# EAGLE design meteo_board (EAGLE 9.6.2)
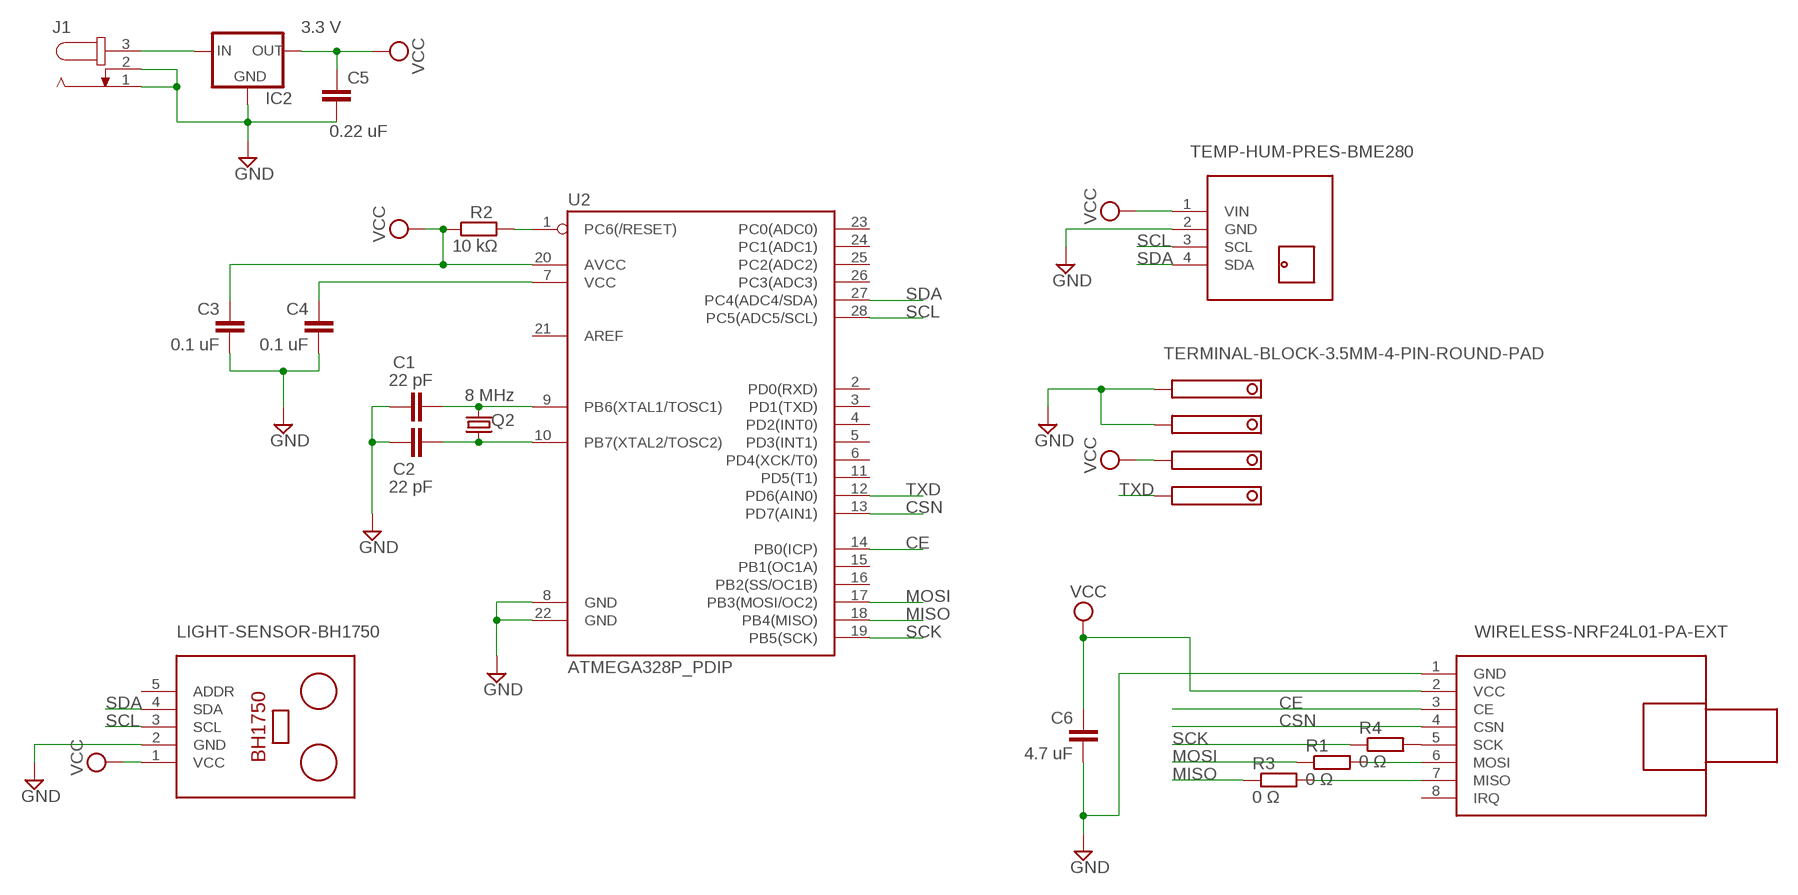
[diagram p0: schematic, sheet 1]

## Parts
C1  22 pF  C2,5-3  [C2.5-3]
C2  22 pF  C2,5-3  [C2.5-3]
C3  0.1 uF  C2,5-3  [C2.5-3]
C4  0.1 uF  C2,5-3  [C2.5-3]
C5  0.22 uF  C2,5-3  [C2.5-3]
C6  4.7 uF  C2,5-3  [C2.5-3]
IC2  LFXXCVS  [TO220S]
J1  JACK-PLUG0  [SPC4077]
M1  WIRELESS-NRF24L01-PA-EXT  [WIRELESS-NRF24L01-PA-EXT]
Q2  8 MHz  CRYSTALHC49S  [HC49/S]
R1  0 Ω  R-EU_0204/5  [0204/5]
R2  10 kΩ  R-EU_0204/5  [0204/5]
R3  0 Ω  R-EU_0204/5  [0204/5]
R4  0 Ω  R-EU_0204/5  [0204/5]
TX20  TERMINAL-BLOCK-3.5MM-4-PIN-ROUND-PAD  [TERMINAL-BLOCK-4-PIN-3.5MM-ROUND-PAD]
U2  ATMEGA328P_PDIP  [DIL28-3]
U$5  LIGHT-SENSOR-BH1750  [LIGHT-SENSOR-BH1750]
U$6  TEMP-HUM-PRES-BME280  [TEMP-HUM-PRES-BME280]

## Nets
CE: M1.3(CE) U2.14(PB0(ICP))
CSN: M1.4(CSN) U2.13(PD7(AIN1))
GND: C1.1 C2.1 C3.1 C4.1 C5.2 C6.1 IC2.2(GND) J1.1 J1.2 M1.1(GND) TX20.1 TX20.2 U2.8(GND) U2.22(GND) U$5.2(GND) U$6.2(GND)
MISO: R3.1 U2.18(PB4(MISO))
MOSI: R1.1 U2.17(PB3(MOSI/OC2))
N$1: IC2.1(IN) J1.3
N$2: R2.2 U2.1(PC6(/RESET))
N$3: M1.5(SCK) R4.2
N$4: C1.2 Q2.2 U2.9(PB6(XTAL1/TOSC1))
N$5: C2.2 Q2.1 U2.10(PB7(XTAL2/TOSC2))
N$6: M1.6(MOSI) R1.2
N$7: M1.7(MISO) R3.2
N$13: C4.2 U2.7(VCC)
SCK: R4.1 U2.19(PB5(SCK))
SCL: U2.28(PC5(ADC5/SCL)) U$5.3(SCL) U$6.3(SCL)
SDA: U2.27(PC4(ADC4/SDA)) U$5.4(SDA) U$6.4(SDA)
TXD: TX20.4 U2.12(PD6(AIN0))
VCC: C3.2 C5.1 C6.2 IC2.3(OUT) M1.2(VCC) R2.1 TX20.3 U2.20(AVCC) U$5.1(VCC) U$6.1(VIN)
Unconnected: M1.8(IRQ) U2.2(PD0(RXD)) U2.3(PD1(TXD)) U2.4(PD2(INT0)) U2.5(PD3(INT1)) U2.6(PD4(XCK/T0)) U2.11(PD5(T1)) U2.15(PB1(OC1A)) U2.16(PB2(SS/OC1B)) U2.21(AREF) U2.23(PC0(ADC0)) U2.24(PC1(ADC1)) U2.25(PC2(ADC2)) U2.26(PC3(ADC3)) U$5.5(ADDR)

## Notes on the sheet
- 3.3 V

## Library data of the parts
C1-C6 = capacitor-wima:C: CAPACITOR naming: grid - package width
IC2 = lf33:LFXXCV: VOLTAGE REGULATOR
J1 = con-jack:JACK-PLUG: DC POWER JACK Power Jack, DC, Right Angle, Through Hole, Rated 5A at 16VDC, PC Terminals Distributor: Farnell (www.Farnell.de) Drawing: 84N1161.pdf / 84N1162.pdf Manufacturer: SPC Technology (www.spctechnology.com) Type: SPC4077 / SPC 4078; OC_FARNELL: unknown; OC_NEWARK: unknown
M1 = diy-modules:WIRELESS-NRF24L01-PA-EXT: 2.4 GHz Wireless Module based on NRF24L01 chip with preamplifier and external antenna Click here to find device on ebay.com <http://www.ebay.com/sch/nrf24l01+pa+lna+sma>
Q2 = crystal:CRYSTAL: CRYSTAL; OC_FARNELL: 1667008; OC_NEWARK: unknown
R1-R4 = rcl:R-EU_: RESISTOR, European symbol; SPICEPREFIX: R
TX20 = Rembrandt Electronics - Terminal Block 3-5mm v1-0:TERMINAL-BLOCK-3.5MM-4-PIN: Terminal Block 3.5mm Pitch: 3,5 mm Number of pins: 4 Created by Rembrandt Electronics www.rembrandtelectronics.com
U2 = Bare Bones Arduino:ATMEGA328P_PDIP: uC used in the Arduino 32kb flash, 1k EEPROM, 2k SRAM This is the through-hole version of this chip.
U$5 = diy-modules:LIGHT-SENSOR-BH1750: Digital Light Sensor based on BH1750 BH1750 datasheet is available here: http://www.mouser.com/ds/2/348/bh1750fvi-e-186247.pdf Arduino Library for BH1750 is available here: https://github.com/claws/BH1750 Video Tutorial is available here: https://www.youtube.com/watch?v=UsLcHSbxf_8 Click here to find device on ebay.com <http://www.ebay.com/sch/bh1750fvi+module> Note: There are many variants. Search for the proper version.
U$6 = diy-modules:TEMP-HUM-PRES-BME280: Digital Humidity-Temperature-Pressure Sensor based on BME280 device More information about BME280 device is available here: https://www.bosch-sensortec.com/bst/products/all_products/bme280 Click here to find device on ebay.com <http://www.ebay.com/sch/bme280+breakout>

## Board
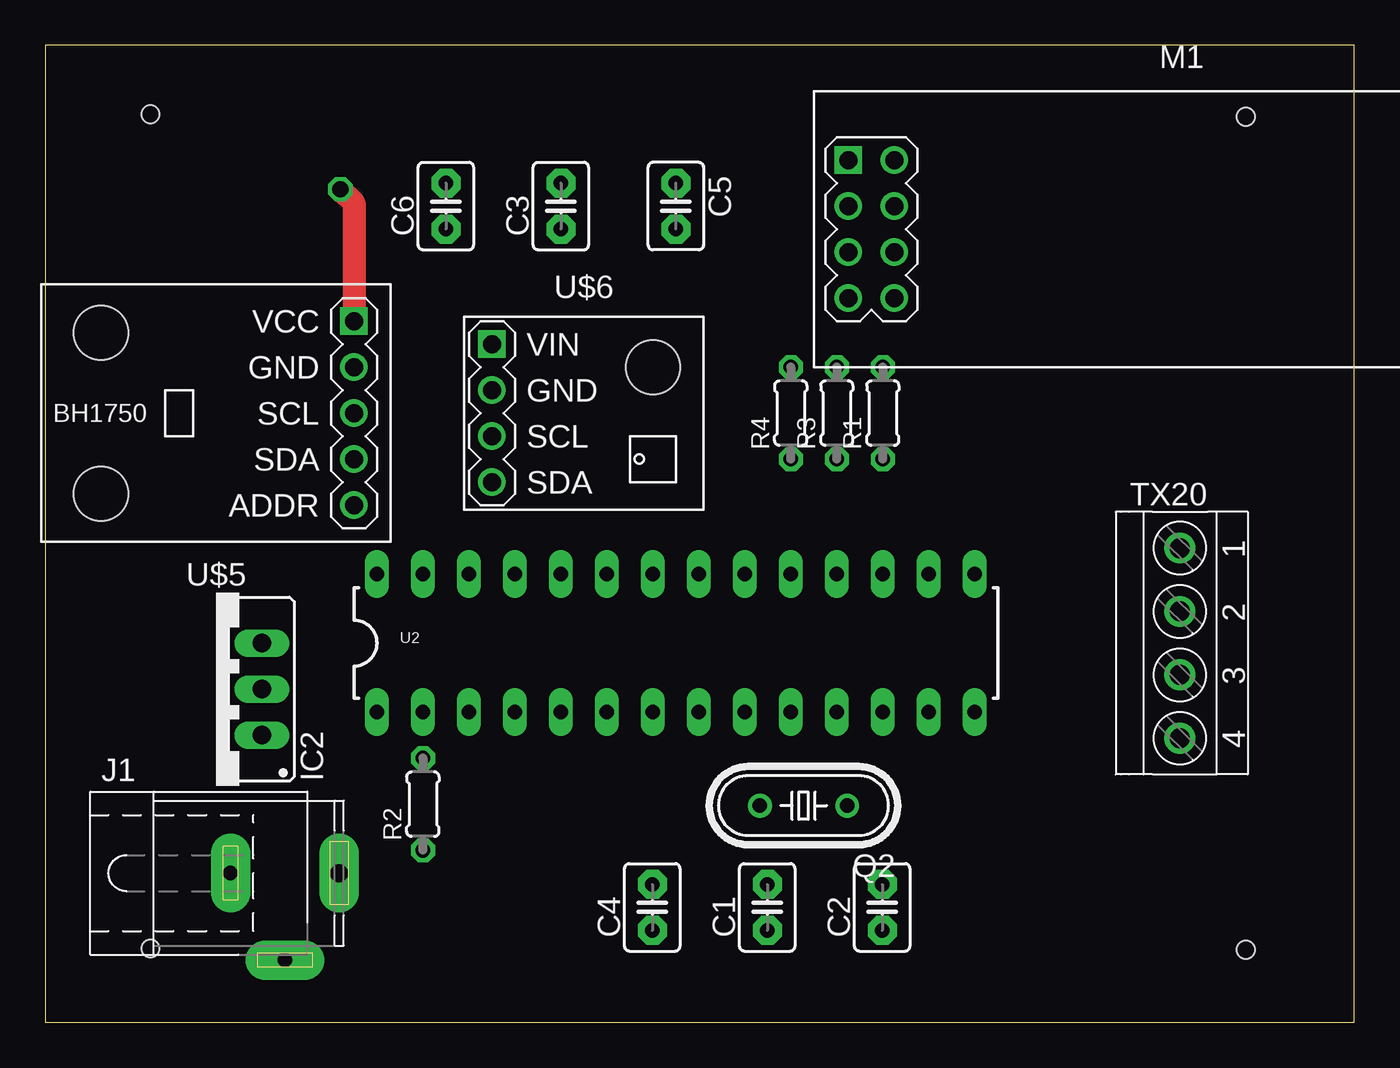
[diagram p1: board, top side]
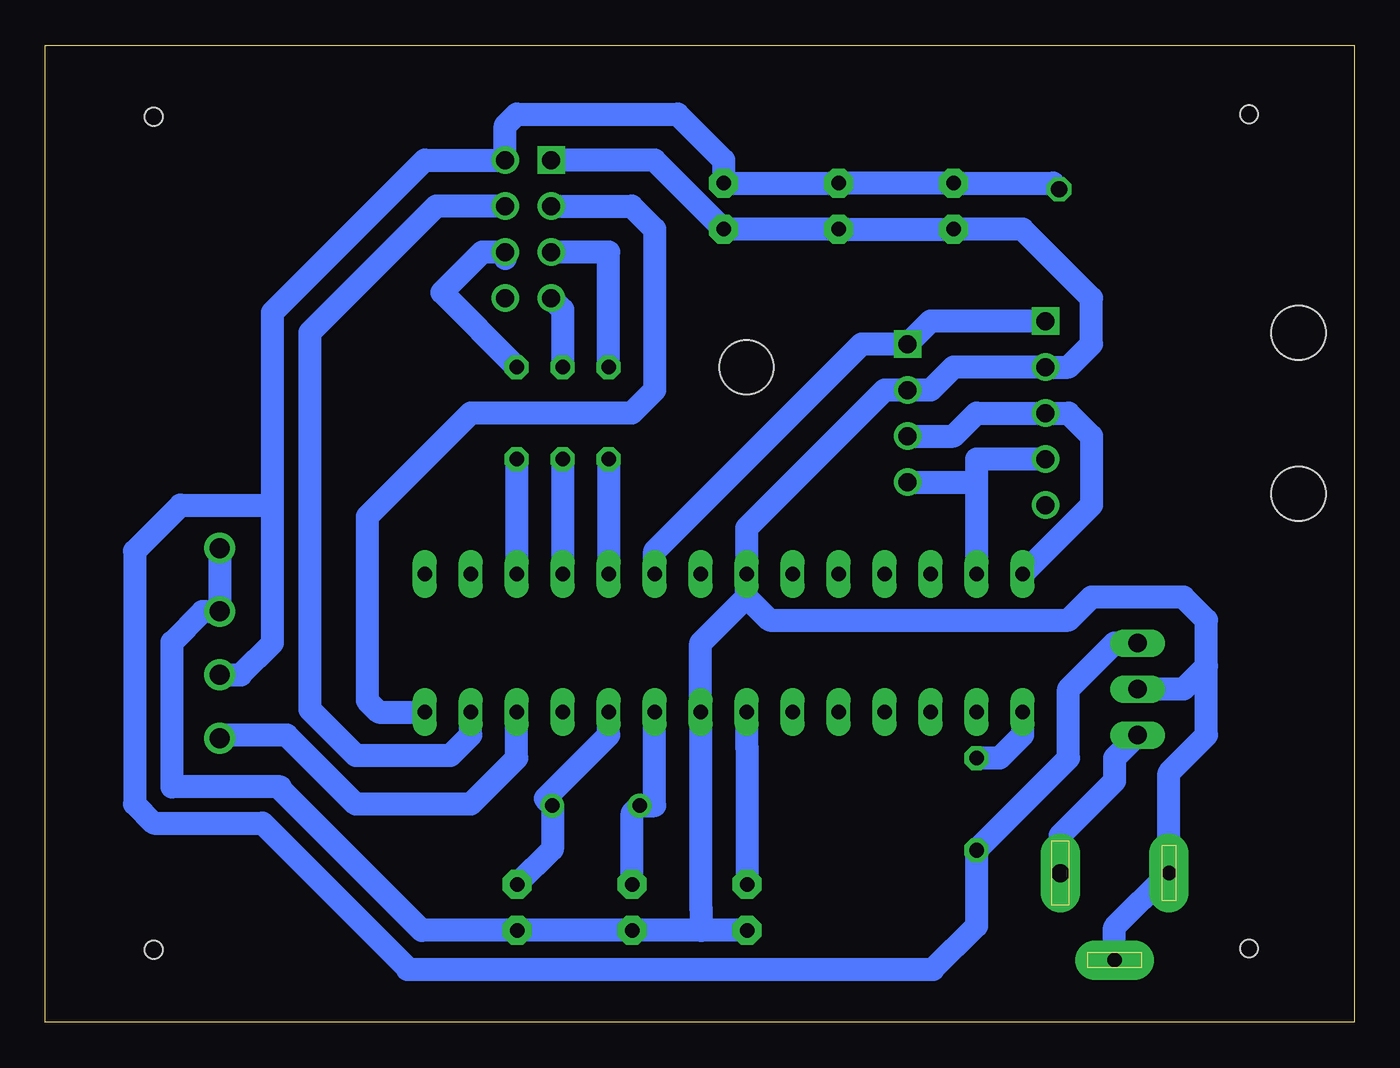
[diagram p2: board, bottom side, seen from below]

Size 72.3 x 53.95 mm. Coordinates in mm from the lower left corner, seen from the top.
Outline: 0,0 72.3,0 72.3,53.95 0,53.95 0,0
Copper layers (1*16): Top 0.035mm / dielectric 1.5mm / Bottom 0.035mm
Design rules "default": minimum track width 6mil, minimum drill 0.35mm, track to track 6mil, track to pad 6mil, pad to pad 6mil, via to via 6mil, smd to smd 6mil, copper to edge 40mil, drill to drill 6mil, minimum pad ring 10mil, minimum via ring 8mil, stop-mask expansion 4mil, vias tented up to drill 0mil, thermal gap 10mil
Holes 1 mm at 5.81,50.15 5.81,4.08 66.3,50 66.3,4

### Footprints (pad centres in the part's own frame; a part is rotated, then mirrored left to right if it is on the bottom)
C2.5-3 = drill 0.813 pad 1.6 octagon: 1 -1.27,0; 2 1.27,0
TO220S = drill 1.016 long: 1 -2.54,-2.54; 2 0,-2.54; 3 2.54,-2.54
SPC4077 = drill 0.8 pad 2.184 long: 1 -3,0; 2 0,-4.8 | drill 1 pad 2.184 long: 3 3,0
WIRELESS-NRF24L01-PA-EXT = drill 1 square: 1 -18.415,3.81 | drill 1: 2 -15.875,3.81; 3 -18.415,1.27; 4 -15.875,1.27; 5 -18.415,-1.27; 6 -15.875,-1.27; 7 -18.415,-3.81; 8 -15.875,-3.81
HC49/S = drill 0.813: 1 -2.413,0; 2 2.413,0
0204/5 = drill 0.813 octagon: 1 -2.54,0; 2 2.54,0
TERMINAL-BLOCK-4-PIN-3.5MM-ROUND-PAD = drill 1.1 pad 1.7: 1 -5.25,-0.1; 2 -1.75,-0.1; 3 1.75,-0.1; 4 5.25,-0.1
DIL28-3 = drill 0.813 long: 1 -16.51,-3.81; 2 -13.97,-3.81; 3 -11.43,-3.81; 4 -8.89,-3.81; 5 -6.35,-3.81; 6 -3.81,-3.81; 7 -1.27,-3.81; 8 1.27,-3.81; 9 3.81,-3.81; 10 6.35,-3.81; 11 8.89,-3.81; 12 11.43,-3.81; 13 13.97,-3.81; 14 16.51,-3.81; 15 16.51,3.81; 16 13.97,3.81; 17 11.43,3.81; 18 8.89,3.81; 19 6.35,3.81; 20 3.81,3.81; 21 1.27,3.81; 22 -1.27,3.81; 23 -3.81,3.81; 24 -6.35,3.81; 25 -8.89,3.81; 26 -11.43,3.81; 27 -13.97,3.81; 28 -16.51,3.81
LIGHT-SENSOR-BH1750 = drill 1 square: 1 -7.62,-5.08 | drill 1: 2 -7.62,-2.54; 3 -7.62,0; 4 -7.62,2.54; 5 -7.62,5.08 | hole 3: 6.35,4.445; 6.35,-4.445
TEMP-HUM-PRES-BME280 = drill 1 square: 1 -5.08,3.81 | drill 1: 2 -5.08,1.27; 3 -5.08,-1.27; 4 -5.08,-3.81 | hole 3: 3.81,2.54

### Placement (x,y rotation side)
C1  39.88,6.35 90 top
C2  46.23,6.35 90 top
C3  28.48,45.07 90 top
C4  33.53,6.35 90 top
C5  34.83,45.07 270 top
C6  22.13,45.07 90 top
IC2  9.43,18.4 90 top
J1  13.24,8.24 0 top
M1  62.77,43.8 0 top
Q2  41.88,11.97 180 top
R1  46.26,33.64 90 top
R2  20.86,12.05 90 top
R3  43.72,33.64 90 top
R4  41.18,33.64 90 top
TX20  62.77,20.94 270 top
U2  34.83,20.94 0 top
U$5  9.43,33.64 180 top
U$6  29.75,33.64 0 top

### Tracks (layer width: path | path; a pad name or v marks a point on that pad's centre or on a via)
CE
  Bottom 1.27: U2.14 53.88,17.13 54.52,17.77 54.52,27.93 48.8,33.64 39.91,33.64 38.64,34.91 38.64,43.8 39.91,45.07 M1.3
CSN
  Bottom 1.27: M1.4 50.7,45.07 57.69,38.09 57.69,17.28 55.15,14.74 49.92,14.74 48.8,15.86 U2.13
GND
  Bottom 1.27: 33.56,23.48 32.29,22.21 15.78,22.21 14.51,23.48 9.43,23.48 8.16,22.21 8.16,19.67 | 33.56,23.48 U2.22 33.56,27.29 25.94,34.91 U$6.2 23.4,34.91 22.13,36.18 U$5.2 15.78,36.18 14.51,37.45 14.51,39.99 18.32,43.8 C6.1 C3.1 C5.2 38.64,47.61 M1.1 | C4.1 36.07,5.08 | 36.07,5.08 C1.1 C2.1 51.5,5.08 59.3,12.88 59.3,13 65.3,13 65.3,21 63.61,22.69 TX20.2 TX20.1 | 36.07,5.08 36.07,6.27 36.1,6.3 U2.8 36.1,20.94 33.56,23.48 | 8.16,19.67 9.43,18.4 IC2.2 | J1.2 13.24,5.24 J1.1 10.24,13.78 8.16,15.86 8.16,19.67
MISO
  Bottom 1.27: R3.1 U2.18
MOSI
  Bottom 1.27: R1.1 U2.17
N$1
  Bottom 1.27: J1.3 16.24,10.32 13.24,13.32 13.24,14.59 IC2.1
N$2
  Bottom 1.27: U2.1 18.32,15.86 19.59,14.59 R2.2
N$3
  Bottom 1.27: R4.2 41.18,42.53 M1.5
N$4
  Bottom 1.27: U2.9 38.64,11.97 Q2.2 39.88,11.56 C1.2
N$5
  Bottom 1.27: U2.10 41.18,15.86 44.68,12.36 Q2.1 44.29,9.56 C2.2
N$6
  Bottom 1.27: 46.89,42.17 M1.6 48.16,42.53 50.39,40.31 R1.2
N$7
  Bottom 1.27: M1.7 43.72,39.35 R3.2
N$13
  Bottom 1.27: U2.7 33.56,15.19 33.53,15.16 C4.2
SCK
  Bottom 1.27: R4.1 U2.19
SCL
  Bottom 1.27: U2.28 14.51,28.56 14.51,32.37 15.78,33.64 U$5.3 20.86,33.64 22.13,32.37 U$6.3
SDA
  Bottom 1.27: U$5.4 20.86,31.1 20.86,29.83 | 20.86,29.83 U2.27 | U$6.4 20.86,29.83
TXD
  Bottom 1.27: U2.12 46.26,14.59 48.8,12.05 55.15,12.05 58.96,15.86 62.5,15.86 TX20.4
VCC  (via drill 0.9 pad 1.3)
  Top 1.27: v16.3,46 17.05,45.25 U$5.1
  Bottom 1.27: TX20.3 61.5,19.19 59.75,20.94 59.75,28.56 | U2.20 38.64,26.02 27.21,37.45 U$6.1 23.4,38.72 U$5.1 | 59.75,28.56 59.75,39.2 51.34,47.61 M1.2 46.89,49.52 46.26,50.15 37.37,50.15 34.83,47.61 C5.1 C3.2 C6.2 16.64,46.34 v16.3,46 | 59.75,28.56 64.83,28.56 67.37,26.02 67.37,12.07 66.3,11 60.3,11 52.3,3 52.3,2.92 23.26,2.92 20.86,5.32 R2.1 15.78,14.59 15.78,18.4 13.24,20.94 IC2.3